# Altium schematic sheet LM358.SchDoc
size A4
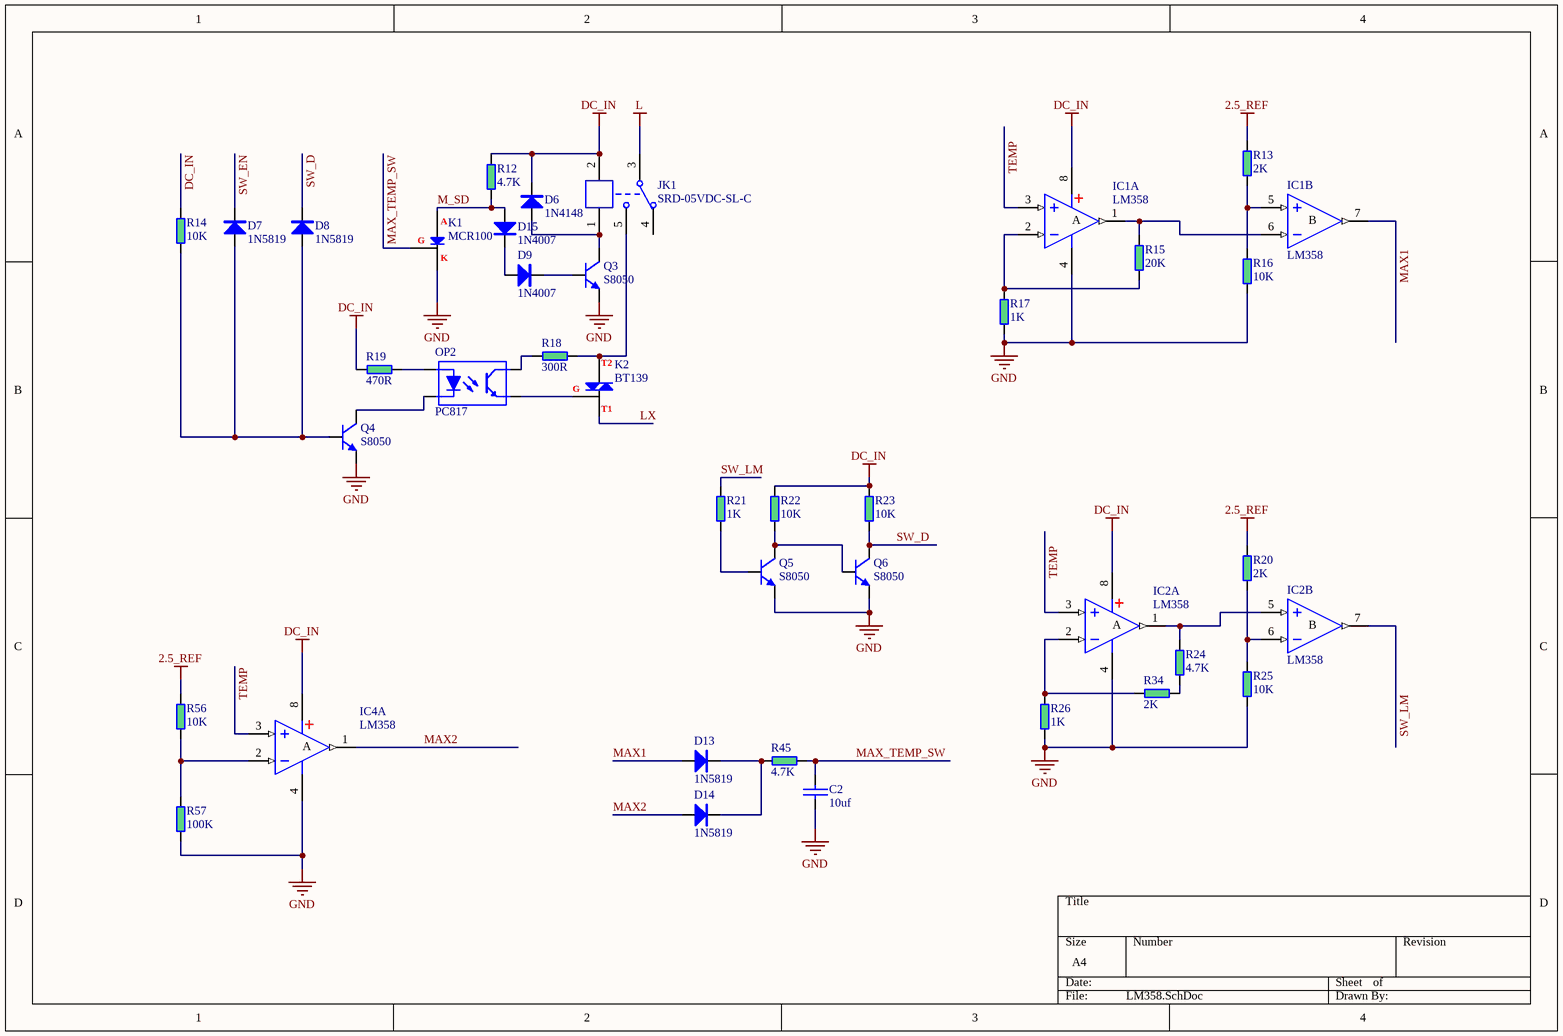
[diagram p0: LM358.SchDoc]

## Parts
C2  value 10uf  [C 0603]  (hidden comment: 04.Cap)
D6  1N4148  [D 1N4148-LL34]
D7  1N5819  [D 1N5819W-SOD123]
D8  1N5819  [D 1N5819W-SOD123]
D9  1N4007  [D 1N4007-SOD123]
D13  1N5819  [D 1N5819W-SOD123]
D14  1N5819  [D 1N5819W-SOD123]
D15  1N4007  [D 1N4007-SOD123]
IC1  LM358  [SOP8]  (parts A,B of 2)
IC2  LM358  [SOP8]  (parts A,B of 2)
IC4  LM358  [SOP8]  (part A of 2)
JK1  SRD-05VDC-SL-C  [SRD-C_B]
K1  MCR100  [IGBT MCR100-SOT23]
K2  BT139  [IGBT BT139]
OP2  PC817  [OP MOC3041]
Q3  S8050  [BJT-S8050-SOT23]
Q4  S8050  [BJT-S8050-SOT23]
Q5  S8050  [BJT-S8050-SOT23]
Q6  S8050  [BJT-S8050-SOT23]
R12  4.7K  [R 0603]
R13  2K  [R 0603]
R14  10K  [R 0603]
R15  20K  [R 0603]
R16  10K  [R 0603]
R17  1K  [R 0603]
R18  300R  [RS 1/4W-V3]
R19  470R  [R 0603]
R20  2K  [R 0603]
R21  1K  [R 0603]
R22  10K  [R 0603]
R23  10K  [R 0603]
R24  4.7K  [R 0603]
R25  10K  [R 0603]
R26  1K  [R 0603]
R34  2K  [R 0603]
R45  4.7K  [R 0603]
R56  10K  [R 0603]
R57  100K  [R 0603]

## Nets
2.5_REF: R13.2 R20.2 R56.2
DC_IN: D6.K IC1.8(V+) IC2.8(V+) IC4.8(V+) JK1.2 R12.2 R14.2 R19.1 R22.2 R23.2
GND: C2.2 IC1.4(V-) IC2.4(V-) IC4.4(V-) K1.K Q3.E Q4.E Q5.E Q6.E R16.1 R17.1 R25.1 R26.1 R57.1
L: JK1.3
LX: K2.T1
M_SD: D15.A K1.A R12.1
MAX1: D13.A IC1.7(OUT)
MAX2: D14.A IC4.1(OUT)
MAX_TEMP_SW: C2.1 K1.G R45.2
SW_D: D8.K Q6.C R23.1
SW_EN: D7.K
SW_LM: IC2.7(OUT) R21.2
TEMP: IC1.3(IN+) IC2.3(IN+) IC4.3(IN+)
NetD6_A: D6.A JK1.1 Q3.C
NetD7_A: D7.A D8.A Q4.B R14.1
NetD9_A: D9.A D15.K
NetD9_K: D9.K Q3.B
NetD13_K: D13.K D14.K R45.1
NetIC1_1: IC1.1(OUT) IC1.6(IN-) R15.2
NetIC1_2: IC1.2(IN-) R15.1 R17.2
NetIC1_5: IC1.5(IN+) R13.1 R16.2
NetIC2_1: IC2.1(OUT) IC2.5(IN+) R24.2
NetIC2_2: IC2.2(IN-) R26.2 R34.1
NetIC2_6: IC2.6(IN-) R20.1 R25.2
NetIC4_2: IC4.2(IN-) R56.1 R57.2
NetJK1_5: JK1.5 K2.T2 R18.2
NetK2_G: K2.G OP2.E
NetOP2_A: OP2.A R19.2
NetOP2_C: OP2.C R18.1
NetOP2_K: OP2.K Q4.C
NetQ5_B: Q5.B R21.1
NetQ5_C: Q5.C Q6.B R22.1
NetR24_1: R24.1 R34.2

Not connected (* = marked no-connect by the designer): JK1 4

## Notes on the sheet
- (in symbol LM358, part A) A
- (in symbol LM358, part B) B

## Library data of the parts
C2 = 04.Cap: 电容
D6-D9 D13-D15 = 12.Diode: 二极管
IC1 IC2 IC4 = LM358: 双路运放; 版权归属: 源创客; BOM名称: 双路运放; 学习资源: www.ooocke.com
JK1 = SRD-05VDC-SL-C: 5V一组转换; BOM名称: 5V继电器; 版权归属: 源创客; 学习资源: www.ooocke.com
K1 = 20.IGBT: 单向可控硅-晶闸管
K2 = 19.IGBT-Bi: 双向可控硅-晶闸管
OP2 = 17.Optocoupler: 光耦
Q3-Q6 = 07.BJT(N): 三极管 NPN
R12-R26 R34 R45 R56 R57 = 01.Res: 电阻